# Altium project Chov2egz10-15.PrjPCB
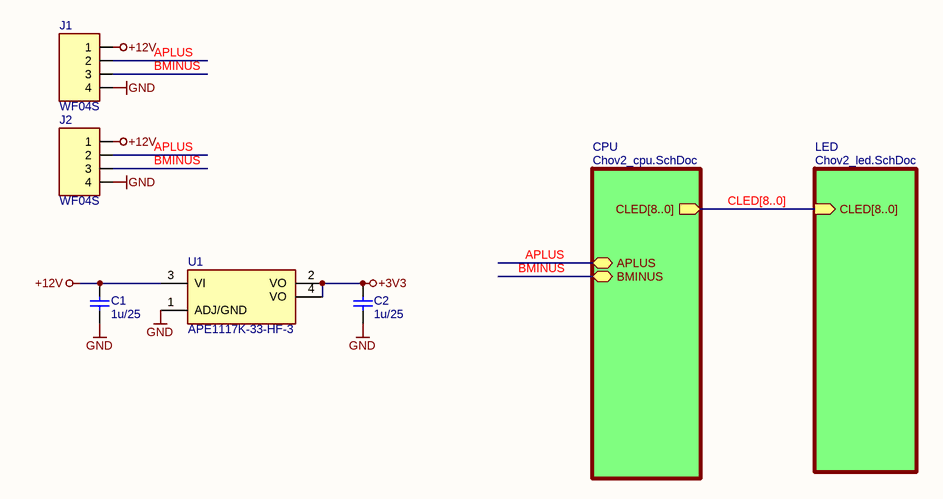
[diagram p0: Chov2_main.SchDoc]
Nazwa_Projektu: Lampka LED na choinkê; Wersja: 2
3 sheets, 66 parts. Net scope: hierarchical (ports join the sheet entries above them; power ports are global).
Board file: Chov2.PcbDoc
Sheets:
  Chov2_main.SchDoc
    CPU = Chov2_cpu.SchDoc
    LED = Chov2_led.SchDoc

## Sheet Chov2_main.SchDoc
size A4; DocumentNumber: 1; SheetNumber: 1; SheetTotal: 3; LotOfPieces: 1

### Parts
C1  OtherParams: 1u/25  [0805]  (hidden comment: CL21B105KAFNNNG)
C2  OtherParams: 1u/25  [0805]  (hidden comment: CL21B105KAFNNNG)
J1  WF04S  [WF04S]
J2  WF04S  [WF04S]
U1  APE1117K-33-HF-3  [SOT-223]

### Sub-sheets
CPU = Chov2_cpu.SchDoc: CLED[8..0], APLUS, BMINUS
LED = Chov2_led.SchDoc: CLED[8..0]

### Nets
+3V3: C2.1 U1.2(VO) U1.4(VO)
+12V: C1.1 J1.1 J2.1 U1.3(VI)
GND: C1.2 C2.2 J1.4 J2.4 U1.1(ADJ/GND)
APLUS: J1.2 J2.2 ; sheet CPU/APLUS
BMINUS: J1.3 J2.3 ; sheet CPU/BMINUS

### Buses and harness runs
bus CLED[8..0] = sheet CPU/CLED[8..0] = sheet LED/CLED[8..0]

### Notes on the sheet
- Wariant:
- Projekt i wykonanie: (C) Miroslaw Lach MRQ, www.mlach.com
- SVNPath:
- Page:
- Rev.
- /
- Plik:

### Library data of the parts
C1 C2 = CL21B105KAFNNNG[[/\]]0805[[/\]]25V[[/\]]10%[[/\]]1u/25: MaxVoltage: 25V; Tolerance: 10%; Descript: Kondensator: ceramiczny; MLCC; 1uF; 25V; X7R; ±10%; SMD; 0805; Currency5: PLN; Value: CL21B105KAFNNNG; Dimensions: 0805; Supplier5: tme.pl; Reference5: CL21B105KAFNNNG; Manufacturer5: Samsung; Typ5: CL21B105KAFNNNG; Price5: 0,051; DateOfPrice5: 2016-08-23
J1 J2 = WF04S[[/\]]WF04S: Descript: connector 2.54mm pitch, THT, 4 pole, straight, male; Currency5: PLN; Value: WF04S; Dimensions: WF04S; Supplier5: maritex.com.pl; Reference5: WF04S; Price5: 0,069; DateOfPrice5: 2015-01-26
U1 = APE1117K-33-HF-3[[/\]]SOT-223: Descript: 1000mA low-dropout linear regulator 3.3V; Typ5: APE1117K-33-HF-3TR; Currency5: PLN; Value: APE1117K-33-HF-3; Dimensions: SOT-223; Supplier5: tme.pl; Reference5: APE1117K-33-HF-3; Manufacturer5: APEC; Price5: 1; DateOfPrice5: 2016-06-06

## Sheet Chov2_cpu.SchDoc
size A4; DocumentNumber: 2; SheetNumber: 2; SheetTotal: 3; LotOfPieces: 1
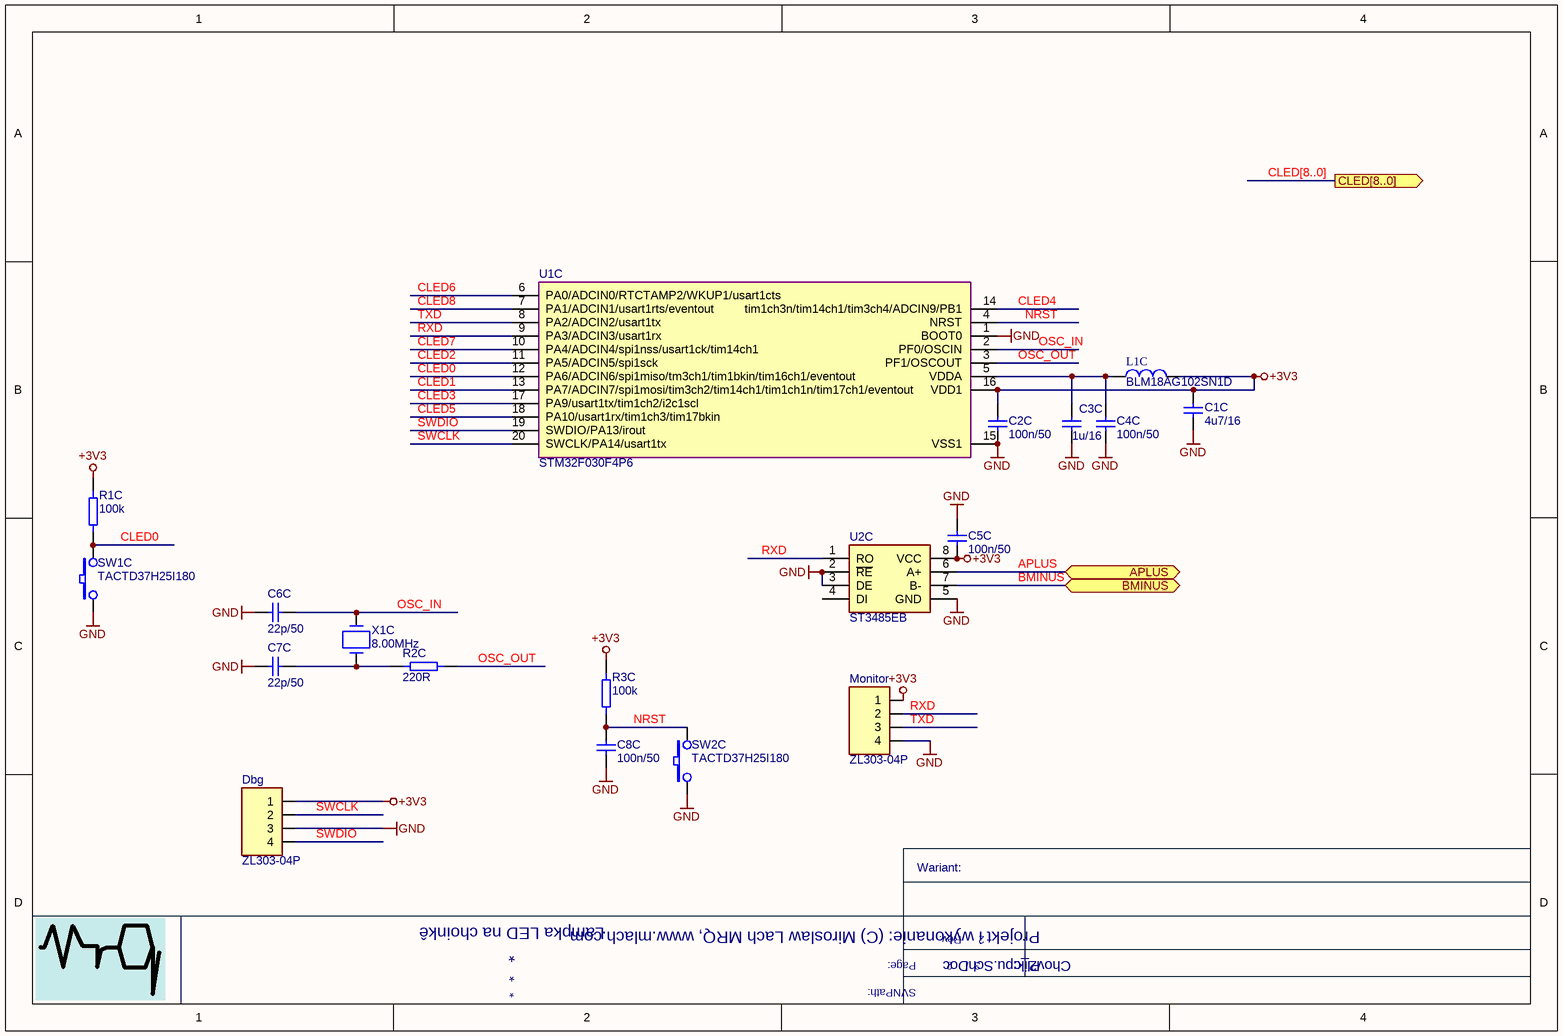
[diagram p1: Chov2_cpu.SchDoc]

### Parts
C1C  OtherParams: 4u7/16  [0805]  (hidden comment: 0805YC475KAT2A)
C2C  OtherParams: 100n/50  [0603-IPC]  (hidden comment: CL10B104JB8NNNC)
C3C  OtherParams: 1u/16  [0603-IPC]  (hidden comment: CL10B105KO8NNNC)
C4C  OtherParams: 100n/50  [0603-IPC]  (hidden comment: CL10B104JB8NNNC)
C5C  OtherParams: 100n/50  [0603-IPC]  (hidden comment: CL10B104JB8NNNC)
C6C  OtherParams: 22p/50  [0603-IPC]  (hidden comment: CC0603JRNPO9BN220)
C7C  OtherParams: 22p/50  [0603-IPC]  (hidden comment: CC0603JRNPO9BN220)
C8C  OtherParams: 100n/50  [0603-IPC]  (hidden comment: CL10B104JB8NNNC)
Dbg  ZL303-04P  [PLMS4S]
L1C  BLM18AG102SN1D  [0603]
Monitor  ZL303-04P  [PLMS4S]
R1C  OtherParams: 100k  [0603-IPC]  (hidden comment: 0603SAF1003T5E)
R2C  OtherParams: 220R  [0603-IPC]  (hidden comment: 0603SAF2200T5E)
R3C  OtherParams: 100k  [0603-IPC]  (hidden comment: 0603SAF1003T5E)
SW1C  TACTD37H25I180  [TACTD37H25I180]
SW2C  TACTD37H25I180  [TACTD37H25I180]
U1C  STM32F030F4P6  [MO-153AC]
U2C  ST3485EB  [8SOIC150]
X1C  8.00MHz  [HC49SMP]

### Ports
APLUS, BMINUS, CLED[8..0]

### Nets
+3V3: C1C.1 C2C.1 C5C.1 Dbg.1 L1C.2 Monitor.1 R1C.1 R3C.1 U1C.16(VDD1) U2C.8(VCC)
GND: C1C.2 C2C.2 C3C.2 C4C.2 C5C.2 C6C.1 C7C.1 C8C.2 Dbg.3 Monitor.4 SW1C.1 SW2C.1 U1C.1(BOOT0) U1C.15(VSS1) U2C.2(~{RE}) U2C.3(DE) U2C.5(GND)
APLUS: U2C.6(A+) ; port APLUS
BMINUS: U2C.7(B-) ; port BMINUS
CLED0: R1C.2 SW1C.2 U1C.12(PA6/ADCIN6/spi1miso/tm3ch1/tim1bkin/tim16ch1/eventout)
CLED1: U1C.13(PA7/ADCIN7/spi1mosi/tim3ch2/tim14ch1/tim1ch1n/tim17ch1/eventout)
CLED2: U1C.11(PA5/ADCIN5/spi1sck)
CLED3: U1C.17(PA9/usart1tx/tim1ch2/i2c1scl)
CLED4: U1C.14(tim1ch3n/tim14ch1/tim3ch4/ADCIN9/PB1)
CLED5: U1C.18(PA10/usart1rx/tim1ch3/tim17bkin)
CLED6: U1C.6(PA0/ADCIN0/RTCTAMP2/WKUP1/usart1cts)
CLED7: U1C.10(PA4/ADCIN4/spi1nss/usart1ck/tim14ch1)
CLED8: U1C.7(PA1/ADCIN1/usart1rts/eventout)
NRST: C8C.1 R3C.2 SW2C.2 U1C.4(NRST)
OSC_IN: C6C.2 U1C.2(PF0/OSCIN) X1C.1
OSC_OUT: R2C.2 U1C.3(PF1/OSCOUT)
RXD: Monitor.2 U1C.9(PA3/ADCIN3/usart1rx) U2C.1(RO)
SWCLK: Dbg.2 U1C.20(SWCLK/PA14/usart1tx)
SWDIO: Dbg.4 U1C.19(SWDIO/PA13/irout)
TXD: Monitor.3 U1C.8(PA2/ADCIN2/usart1tx)
NetC3C_1: C3C.1 C4C.1 L1C.1 U1C.5(VDDA)
NetC7C_2: C7C.2 R2C.1 X1C.2

Not connected (* = marked no-connect by the designer): U2C 4(DI)

### Buses and harness runs
bus CLED[8..0] = port CLED[8..0]

### Notes on the sheet
- Wariant:
- Projekt i wykonanie: (C) Miroslaw Lach MRQ, www.mlach.com
- SVNPath:
- Page:
- Rev.
- /
- Plik:

### Library data of the parts
C1C = 0805YC475KAT2A[[/\]]0805[[/\]]16V[[/\]]10%[[/\]]4u7/16: MaxVoltage: 16V; Tolerance: 10%; Descript: capacitor 4.7uF,16V, X7R, 0805; Currency5: PLN; Value: 0805YC475KAT2A; Dimensions: 0805; Supplier5: tme.pl; Reference5: 0805YC475KAT2A; Manufacturer5: AVX; Typ5: 0805YC475KAT2A; Price5: 0,25; DateOfPrice5: 2016-08-23
C2C C4C C5C C8C = CL10B104JB8NNNC[[/\]]0603[[/\]]50V[[/\]]10%[[/\]]100n/50: MaxVoltage: 50V; Tolerance: 10%; Descript: capacitor 100nF, 50V, X7R, 603, 10%; Currency5: PLN; Value: CL10B104JB8NNNC; Dimensions: 0603; Supplier5: tme.pl; Reference5: CL10B104JB8NNNC; Manufacturer5: Samsung; Typ5: CL10B104JB8NNNC; Price5: 0,02105; DateOfPrice5: 2016-08-17
C3C = CL10B105KO8NNNC[[/\]]0603[[/\]]16V[[/\]]10%[[/\]]1u/16: MaxVoltage: 16V; Tolerance: 10%; Descript: capacitor 1uF, 16V, 0603, 10%, X7R; Currency5: PLN; Value: CL10B105KO8NNNC; Dimensions: 0603; Supplier5: tme.pl; Reference5: CL10B105KO8NNNC; Manufacturer5: Samsung; Typ5: CL10B105KO8NNNC; Price5: 0,02848; DateOfPrice5: 2016-02-11
C6C C7C = CC0603JRNPO9BN220[[/\]]0603[[/\]]50V[[/\]]5%[[/\]]22p/50: MaxVoltage: 50V; Tolerance: 5%; Descript: Kondensator: ceramiczny; MLCC; 22pF; 50V; C0G; ±5%; SMD; 0603; Reference5: CC0603JRNPO9220; Currency5: PLN; Value: CC0603JRNPO9BN220; Dimensions: 0603; Supplier5: tme.pl; Manufacturer5: Yageo; Typ5: CC0603JRNPO9BN220; Price5: 0,027; DateOfPrice5: 2014-11-10
Dbg Monitor = ZL303-04P[[/\]]4x2mm: Descript: connector 2.00mm pitch, 4 poles, one row; Currency5: PLN; Value: ZL303-04P; Dimensions: 4x2mm; Supplier5: tme.pl; Reference5: ZL303-04P; Price5: 0,23067; DateOfPrice5: 2016-08-23; Manufacturer5: Ninigi; Typ5: ZL303-04P
L1C = BLM18AG102SN1D[[/\]]0603[[/\]]BLM18AG102SN1D: Descript: Chip inductor SMD, 0603, Imax=0.4A,Z=1000ohm,  Rdc=0.15ohm; Currency5: PLN; Value: BLM18AG102SN1D; OtherParams: BLM18AG102SN1D; Dimensions: 0603; Supplier5: tme.pl; Reference5: BLM18AG102SN1D; Manufacturer5: Murata; Typ5: BLM18AG102SN1D; Price5: 0,07377; DateOfPrice5: 2016-06-06
R1C = 0603SAF1003T5E[[/\]]0603[[/\]]0.1W[[/\]]1%[[/\]]100k: DissPower: 0.1W; Tolerance: 1%; Descript: Rezystor: thick film; SMD; 0603; 100k?; 0,1W; ±1%; -55÷125°C; Reference5: SMD0603-100K-1%; Currency5: PLN; Value: 0603SAF1003T5E; Dimensions: 0603; Supplier5: tme.pl; Manufacturer5: Royal Ohm; Typ5: 0603SAF1003T5E; Price5: 0,02511; DateOfPrice5: 2016-02-11
R2C = 0603SAF2200T5E[[/\]]0603[[/\]]0.1W[[/\]]1%[[/\]]220R: DissPower: 0.1W; Tolerance: 1%; Descript: Resistor 220ohm, 0603, 1%; Reference5: SMD0603-220R-1%; Currency5: PLN; Value: 0603SAF2200T5E; Dimensions: 0603; Supplier5: tme.pl; Manufacturer5: Royal Ohm; Typ5: 0603SAF2200T5E; Price5: 0,025; DateOfPrice5: 2014-08-05
R3C = 0603SAF1003T5E[[/\]]0603[[/\]]0.1W[[/\]]1%[[/\]]100k: Descript: Rezystor: thick film; SMD; 0603; 100k?; 0,1W; ±1%; -55÷125°C; DissPower: 0.1W; Tolerance: 1%; Reference5: SMD0603-100K-1%; Currency5: PLN; Value: 0603SAF1003T5E; Dimensions: 0603; Supplier5: tme.pl; Manufacturer5: Royal Ohm; Typ5: 0603SAF1003T5E; Price5: 0,02511; DateOfPrice5: 2016-02-11
SW1C SW2C = TACTD37H25I180[[/\]]3.7x6.1x2.5: Descript: TACT switch 3.7x6.1x2.5, SMD, dustproof; Currency5: PLN; Value: TACTD37H25I180; Dimensions: 3.7x6.1x2.5; Supplier5: maritex.com.pl; Reference5: TACTD37H25I180; Manufacturer5: www.innocentswitch.co.kr; Price5: 0,54; DateOfPrice5: 2016-06-06; OtherParams: TACTD37H25I180
U1C = STM32F030F4P6[[/\]]MO-153AC: Descript: ARM Cortex-M0 CPU, 16kB Flash, 4kB RAM, UART, I2C, SPI, ADC, TSSOP20, STM, RoHS; Currency5: PLN; Value: STM32F030F4P6; Dimensions: MO-153AC; Supplier5: kamami.pl; Reference5: STM32F030F4P6; Manufacturer5: ST; Typ5: STM32F030F4P6; Price5: 3,8293; DateOfPrice5: 2016-04-09
U2C = ST3485EB[[/\]]8SOIC150: Descript: 3.3V powered, 15kV ESD protected, up to 12Mbps RS485/RS422 transceiver; Reference5: ST3485EBD; Currency5: PLN; Value: ST3485EB; Dimensions: 8SOIC150; ComponentLink1Description: Datasheet; ComponentLink1URL: http://www.mrq-ml.com/Parts/ICs/ST3485.pdf; Supplier5: tme.pl; Manufacturer5: ST; Typ5: ST3485EBD; Price5: 3,89; DateOfPrice5: 2013-08-26
X1C = 8.00MHz[[/\]]HC49/4HSMX[[/\]]8.00MHz: Descript: crystal 8MHz, 1; Reference5: 8.00M-SMDHC49S; Currency5: PLN; Value: 8.00MHz; OtherParams: 8.00MHz; Dimensions: HC49/4HSMX; Supplier5: tme.pl; Price5: 1,5242; DateOfPrice5: 2016-08-23; Manufacturer5: YIC

## Sheet Chov2_led.SchDoc
size A4; DocumentNumber: 3; SheetNumber: 3; SheetTotal: 3; LotOfPieces: 1
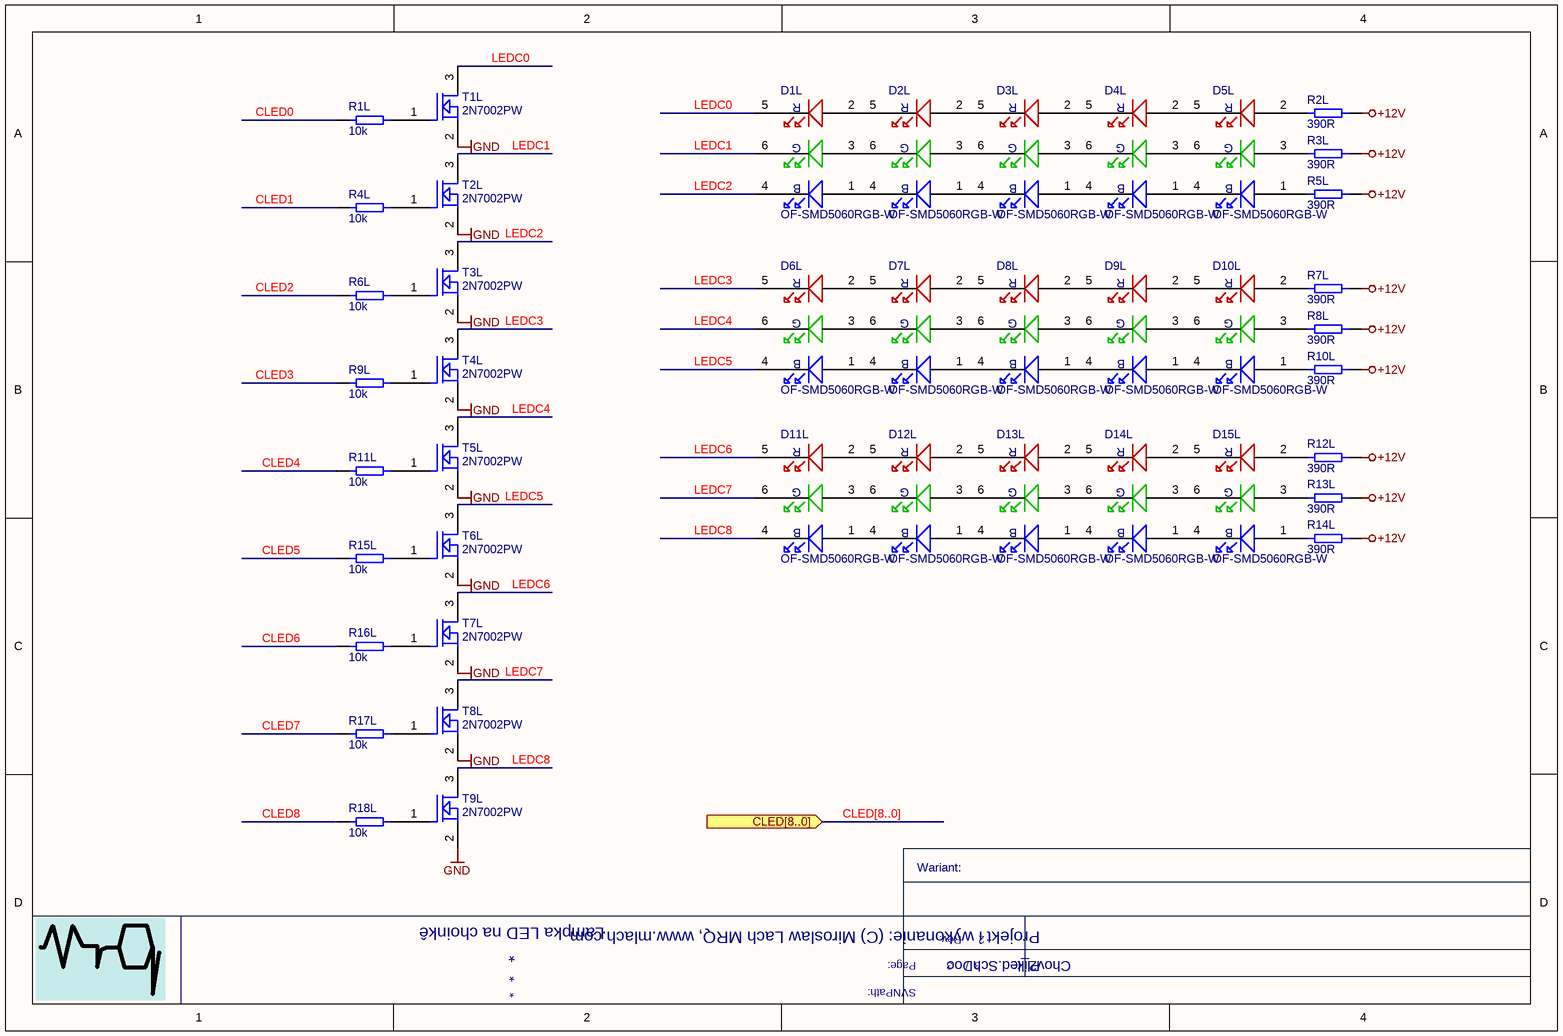
[diagram p2: Chov2_led.SchDoc]

### Parts
D1L  OF-SMD5060RGB-W  [OF-SMD5060RGB-W]
D2L  OF-SMD5060RGB-W  [OF-SMD5060RGB-W]
D3L  OF-SMD5060RGB-W  [OF-SMD5060RGB-W]
D4L  OF-SMD5060RGB-W  [OF-SMD5060RGB-W]
D5L  OF-SMD5060RGB-W  [OF-SMD5060RGB-W]
D6L  OF-SMD5060RGB-W  [OF-SMD5060RGB-W]
D7L  OF-SMD5060RGB-W  [OF-SMD5060RGB-W]
D8L  OF-SMD5060RGB-W  [OF-SMD5060RGB-W]
D9L  OF-SMD5060RGB-W  [OF-SMD5060RGB-W]
D10L  OF-SMD5060RGB-W  [OF-SMD5060RGB-W]
D11L  OF-SMD5060RGB-W  [OF-SMD5060RGB-W]
D12L  OF-SMD5060RGB-W  [OF-SMD5060RGB-W]
D13L  OF-SMD5060RGB-W  [OF-SMD5060RGB-W]
D14L  OF-SMD5060RGB-W  [OF-SMD5060RGB-W]
D15L  OF-SMD5060RGB-W  [OF-SMD5060RGB-W]
R1L  OtherParams: 10k  [0603-IPC]  (hidden comment: 0603WGF10KT5E)
R2L  OtherParams: 390R  [0805]  (hidden comment: 0805WAF 390R T5E)
R3L  OtherParams: 390R  [0805]  (hidden comment: 0805WAF 390R T5E)
R4L  OtherParams: 10k  [0603-IPC]  (hidden comment: 0603WGF10KT5E)
R5L  OtherParams: 390R  [0805]  (hidden comment: 0805WAF 390R T5E)
R6L  OtherParams: 10k  [0603-IPC]  (hidden comment: 0603WGF10KT5E)
R7L  OtherParams: 390R  [0805]  (hidden comment: 0805WAF 390R T5E)
R8L  OtherParams: 390R  [0805]  (hidden comment: 0805WAF 390R T5E)
R9L  OtherParams: 10k  [0603-IPC]  (hidden comment: 0603WGF10KT5E)
R10L  OtherParams: 390R  [0805]  (hidden comment: 0805WAF 390R T5E)
R11L  OtherParams: 10k  [0603-IPC]  (hidden comment: 0603WGF10KT5E)
R12L  OtherParams: 390R  [0805]  (hidden comment: 0805WAF 390R T5E)
R13L  OtherParams: 390R  [0805]  (hidden comment: 0805WAF 390R T5E)
R14L  OtherParams: 390R  [0805]  (hidden comment: 0805WAF 390R T5E)
R15L  OtherParams: 10k  [0603-IPC]  (hidden comment: 0603WGF10KT5E)
R16L  OtherParams: 10k  [0603-IPC]  (hidden comment: 0603WGF10KT5E)
R17L  OtherParams: 10k  [0603-IPC]  (hidden comment: 0603WGF10KT5E)
R18L  OtherParams: 10k  [0603-IPC]  (hidden comment: 0603WGF10KT5E)
T1L  2N7002PW  [SOT323-3_FLOW]
T2L  2N7002PW  [SOT323-3_FLOW]
T3L  2N7002PW  [SOT323-3_FLOW]
T4L  2N7002PW  [SOT323-3_FLOW]
T5L  2N7002PW  [SOT323-3_FLOW]
T6L  2N7002PW  [SOT323-3_FLOW]
T7L  2N7002PW  [SOT323-3_FLOW]
T8L  2N7002PW  [SOT323-3_FLOW]
T9L  2N7002PW  [SOT323-3_FLOW]

### Ports
CLED[8..0]

### Nets
+12V: R2L.2 R3L.2 R5L.2 R7L.2 R8L.2 R10L.2 R12L.2 R13L.2 R14L.2
GND: T1L.2(SOURCE) T2L.2(SOURCE) T3L.2(SOURCE) T4L.2(SOURCE) T5L.2(SOURCE) T6L.2(SOURCE) T7L.2(SOURCE) T8L.2(SOURCE) T9L.2(SOURCE)
CLED0: R1L.1
CLED1: R4L.1
CLED2: R6L.1
CLED3: R9L.1
CLED4: R11L.1
CLED5: R15L.1
CLED6: R16L.1
CLED7: R17L.1
CLED8: R18L.1
LEDC0: D1L.5(CATH) T1L.3(DRAIN)
LEDC1: D1L.6(CATH) T2L.3(DRAIN)
LEDC2: D1L.4(CATH) T3L.3(DRAIN)
LEDC3: D6L.5(CATH) T4L.3(DRAIN)
LEDC4: D6L.6(CATH) T5L.3(DRAIN)
LEDC5: D6L.4(CATH) T6L.3(DRAIN)
LEDC6: D11L.5(CATH) T7L.3(DRAIN)
LEDC7: D11L.6(CATH) T8L.3(DRAIN)
LEDC8: D11L.4(CATH) T9L.3(DRAIN)
NetD1L_1: D1L.1(ANOD) D2L.4(CATH)
NetD1L_2: D1L.2(ANOD) D2L.5(CATH)
NetD1L_3: D1L.3(ANOD) D2L.6(CATH)
NetD2L_1: D2L.1(ANOD) D3L.4(CATH)
NetD2L_2: D2L.2(ANOD) D3L.5(CATH)
NetD2L_3: D2L.3(ANOD) D3L.6(CATH)
NetD3L_1: D3L.1(ANOD) D4L.4(CATH)
NetD3L_2: D3L.2(ANOD) D4L.5(CATH)
NetD3L_3: D3L.3(ANOD) D4L.6(CATH)
NetD4L_1: D4L.1(ANOD) D5L.4(CATH)
NetD4L_2: D4L.2(ANOD) D5L.5(CATH)
NetD4L_3: D4L.3(ANOD) D5L.6(CATH)
NetD5L_1: D5L.1(ANOD) R5L.1
NetD5L_2: D5L.2(ANOD) R2L.1
NetD5L_3: D5L.3(ANOD) R3L.1
NetD6L_1: D6L.1(ANOD) D7L.4(CATH)
NetD6L_2: D6L.2(ANOD) D7L.5(CATH)
NetD6L_3: D6L.3(ANOD) D7L.6(CATH)
NetD7L_1: D7L.1(ANOD) D8L.4(CATH)
NetD7L_2: D7L.2(ANOD) D8L.5(CATH)
NetD7L_3: D7L.3(ANOD) D8L.6(CATH)
NetD8L_1: D8L.1(ANOD) D9L.4(CATH)
NetD8L_2: D8L.2(ANOD) D9L.5(CATH)
NetD8L_3: D8L.3(ANOD) D9L.6(CATH)
NetD9L_1: D9L.1(ANOD) D10L.4(CATH)
NetD9L_2: D9L.2(ANOD) D10L.5(CATH)
NetD9L_3: D9L.3(ANOD) D10L.6(CATH)
NetD10L_1: D10L.1(ANOD) R10L.1
NetD10L_2: D10L.2(ANOD) R7L.1
NetD10L_3: D10L.3(ANOD) R8L.1
NetD11L_1: D11L.1(ANOD) D12L.4(CATH)
NetD11L_2: D11L.2(ANOD) D12L.5(CATH)
NetD11L_3: D11L.3(ANOD) D12L.6(CATH)
NetD12L_1: D12L.1(ANOD) D13L.4(CATH)
NetD12L_2: D12L.2(ANOD) D13L.5(CATH)
NetD12L_3: D12L.3(ANOD) D13L.6(CATH)
NetD13L_1: D13L.1(ANOD) D14L.4(CATH)
NetD13L_2: D13L.2(ANOD) D14L.5(CATH)
NetD13L_3: D13L.3(ANOD) D14L.6(CATH)
NetD14L_1: D14L.1(ANOD) D15L.4(CATH)
NetD14L_2: D14L.2(ANOD) D15L.5(CATH)
NetD14L_3: D14L.3(ANOD) D15L.6(CATH)
NetD15L_1: D15L.1(ANOD) R14L.1
NetD15L_2: D15L.2(ANOD) R12L.1
NetD15L_3: D15L.3(ANOD) R13L.1
NetR1L_2: R1L.2 T1L.1(GATE)
NetR4L_2: R4L.2 T2L.1(GATE)
NetR6L_2: R6L.2 T3L.1(GATE)
NetR9L_2: R9L.2 T4L.1(GATE)
NetR11L_2: R11L.2 T5L.1(GATE)
NetR15L_2: R15L.2 T6L.1(GATE)
NetR16L_2: R16L.2 T7L.1(GATE)
NetR17L_2: R17L.2 T8L.1(GATE)
NetR18L_2: R18L.2 T9L.1(GATE)

### Buses and harness runs
bus CLED[8..0] = port CLED[8..0]

### Notes on the sheet
- Wariant:
- Projekt i wykonanie: (C) Miroslaw Lach MRQ, www.mlach.com
- SVNPath:
- Page:
- Rev.
- /
- Plik:
- (in symbol OF-SMD5060RGB-W[[/\]]5060) R; G; B

### Library data of the parts
D1L D2L D3L D4L D5L D6L D7L D8L D9L D10L D11L D12L D13L D14L D15L = OF-SMD5060RGB-W[[/\]]5060: Descript: 5050 Single Chip RGB Color Top LED; Currency5: PLN; Value: OF-SMD5060RGB-W; Dimensions: 5060; Supplier5: tme.pl; Reference5: OF-SMD5060RGB-W; Manufacturer5: Optoflash; Typ5: OF-SMD5060RGB-W; Price5: 1,3206; DateOfPrice5: 2014-01-04
R1L R4L R6L R9L R11L R15L R16L R17L R18L = 0603WGF10KT5E[[/\]]0603[[/\]]0.1W[[/\]]1%[[/\]]10k: DissPower: 0.1W; Tolerance: 1%; Descript: Resistor 10kohm, 0603, 1%; Reference5: SMD0603-10K-1%; Currency5: PLN; Value: 0603WGF10KT5E; Dimensions: 0603; Supplier5: tme.pl; Manufacturer5: Royal Ohm; Typ5: 0603WGF 10K T5E; Price5: 0,02755; DateOfPrice5: 2016-06-02
R2L R3L R5L R7L R8L R10L R12L R13L R14L = 0805WAF 390R T5E[[/\]]0805[[/\]]0.125W[[/\]]1%[[/\]]390R: DissPower: 0.125W; Tolerance: 1%; Descript: Resistor 390ohm, 0805, 1%; Reference5: SMD0805-390R-1%; Currency5: PLN; Value: 0805WAF 390R T5E; Dimensions: 0805; Supplier5: tme.pl; Manufacturer5: Royal Ohm; Typ5: 0805WAF 390R T5E; Price5: 0,04; DateOfPrice5: 2016-12-13
T1L T2L T3L T4L T5L T6L T7L T8L T9L = 2N7002PW[[/\]]SOT323-3: Descript: N-channel enhacement-mode vertical DMOS FET; Reference5: 1829184; Currency5: PLN; Value: 2N7002PW; Dimensions: SOT323-3; Supplier5: farnell.com; Price5: 0,88; DateOfPrice5: 2016-04-09; Manufacturer5: NXP; Typ5: 2N7002PW

## Nets that join several sheets
+3V3: Chov2_main (C2.1 U1.2 U1.4), Chov2_cpu (10 pins)
+12V: Chov2_main (C1.1 J1.1 J2.1 U1.3), Chov2_led (9 pins)
GND: Chov2_main (5 pins), Chov2_cpu (17 pins), Chov2_led (9 pins)
APLUS: Chov2_main (J1.2 J2.2), Chov2_cpu (U2C.6)
BMINUS: Chov2_main (J1.3 J2.3), Chov2_cpu (U2C.7)
CLED0: Chov2_cpu (R1C.2 SW1C.2 U1C.12), Chov2_led (R1L.1)
CLED1: Chov2_cpu (U1C.13), Chov2_led (R4L.1)
CLED2: Chov2_cpu (U1C.11), Chov2_led (R6L.1)
CLED3: Chov2_cpu (U1C.17), Chov2_led (R9L.1)
CLED4: Chov2_cpu (U1C.14), Chov2_led (R11L.1)
CLED5: Chov2_cpu (U1C.18), Chov2_led (R15L.1)
CLED6: Chov2_cpu (U1C.6), Chov2_led (R16L.1)
CLED7: Chov2_cpu (U1C.10), Chov2_led (R17L.1)
CLED8: Chov2_cpu (U1C.7), Chov2_led (R18L.1)

## Assembly variants
3x1LED: not fitted D1L D2L D3L D4L D6L D7L D8L D9L D11L D12L D13L D14L U2C